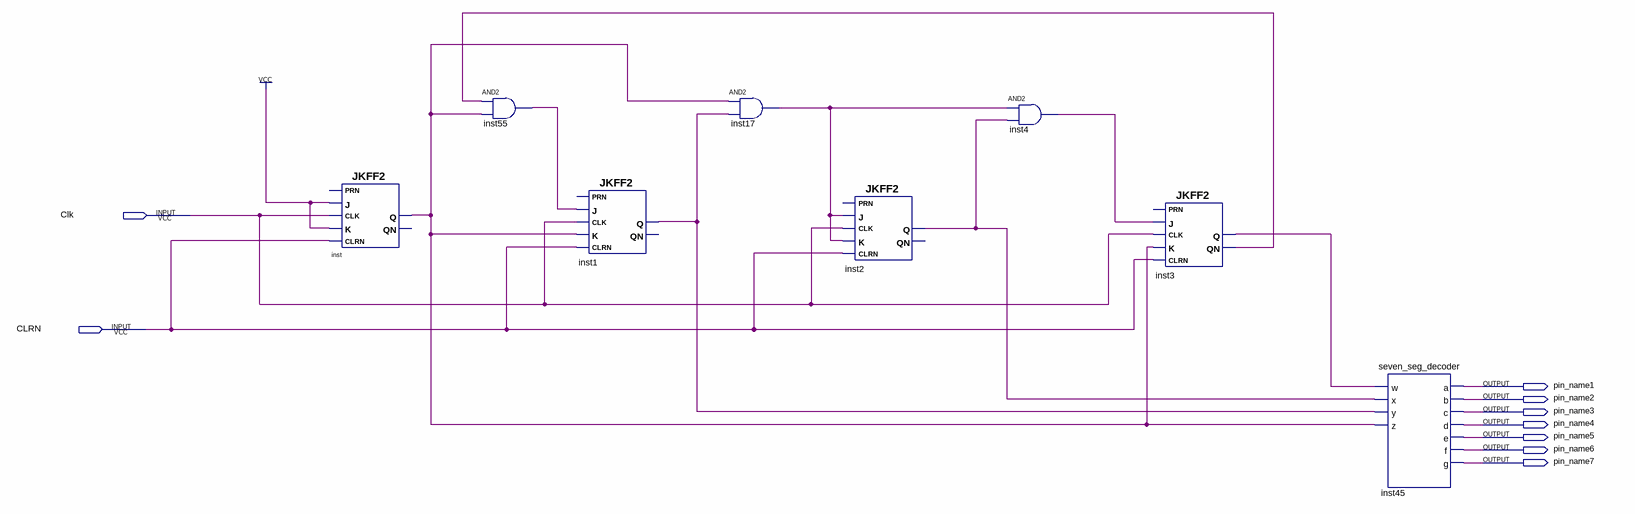
[diagram p0: schematic sheet]
// Quartus schematic scoreCounterZerotoNine.bdf as structural Verilog: 8 symbols, 9 pins
module scoreCounterZerotoNine (
  input  Clk,
  input  CLRN,
  output pin_name1,
  output pin_name2,
  output pin_name3,
  output pin_name4,
  output pin_name5,
  output pin_name6,
  output pin_name7
);

  wire inst1_q, inst2_q, inst3_q, inst3_qn, inst4_out, inst17_out, inst55_out, inst_q;

  JKFF2 inst (.K(1'b1), .CLRN(CLRN), .CLK(Clk), .J(1'b1), .Q(inst_q));  // open: PRN, QN
  and inst55 (inst55_out, inst3_qn, inst_q);
  JKFF2 inst1 (.K(inst_q), .CLRN(CLRN), .CLK(Clk), .J(inst55_out), .Q(inst1_q));  // open: PRN, QN
  and inst17 (inst17_out, inst_q, inst1_q);
  JKFF2 inst2 (.K(inst17_out), .CLRN(CLRN), .CLK(Clk), .J(inst17_out), .Q(inst2_q));  // open: PRN, QN
  and inst4 (inst4_out, inst17_out, inst2_q);
  JKFF2 inst3 (.K(inst_q), .CLRN(CLRN), .CLK(Clk), .J(inst4_out), .QN(inst3_qn), .Q(inst3_q));  // open: PRN
  seven_seg_decoder inst45 (
    .w(inst3_q), .x(inst2_q), .y(inst1_q), .z(inst_q), .a(pin_name1), .b(pin_name2), .c(pin_name3),
    .d(pin_name4), .e(pin_name5), .f(pin_name6), .g(pin_name7));
endmodule
